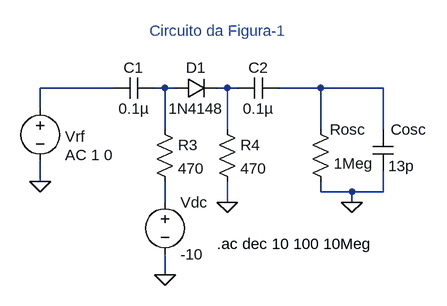
[diagram p0: schematic Chave_RF_1.asc]
Chave_RF_1.asc, the LTspice schematic file:
Version 4
SHEET 1 880 680
WIRE 80 176 -32 176
WIRE 160 176 144 176
WIRE 176 176 160 176
WIRE 256 176 240 176
WIRE 272 176 256 176
WIRE 400 176 336 176
WIRE 496 176 400 176
WIRE -32 208 -32 176
WIRE 160 240 160 176
WIRE 256 240 256 176
WIRE 400 240 400 176
WIRE 496 240 496 176
WIRE -32 320 -32 288
WIRE 400 336 400 320
WIRE 448 336 400 336
WIRE 496 336 496 304
WIRE 496 336 448 336
WIRE 160 352 160 320
WIRE 256 352 256 320
WIRE 448 352 448 336
WIRE 160 464 160 432
FLAG -32 320 0
FLAG 160 464 0
FLAG 256 352 0
FLAG 448 352 0
SYMBOL diode 176 192 R270
WINDOW 0 32 32 VTop 2
WINDOW 3 0 32 VBottom 2
SYMATTR InstName D1
SYMATTR Value 1N4148
SYMBOL cap 80 192 R270
WINDOW 0 32 32 VTop 2
WINDOW 3 0 32 VBottom 2
SYMATTR InstName C1
SYMATTR Value 0.1µ
SYMBOL cap 272 192 R270
WINDOW 0 32 32 VTop 2
WINDOW 3 0 32 VBottom 2
SYMATTR InstName C2
SYMATTR Value 0.1µ
SYMBOL voltage -32 192 R0
WINDOW 0 38 59 Left 2
WINDOW 123 38 87 Left 2
SYMATTR InstName Vrf
SYMATTR Value2 AC 1 0
SYMATTR Value ""
SYMATTR SpiceLine Rser=0
SYMBOL res 144 224 R0
SYMATTR InstName R3
SYMATTR Value 470
SYMBOL voltage 160 336 R0
WINDOW 123 0 0 Left 0
WINDOW 39 0 0 Left 0
SYMATTR InstName Vdc
SYMATTR Value -10
SYMBOL res 240 224 R0
SYMATTR InstName R4
SYMATTR Value 470
SYMBOL res 384 224 R0
WINDOW 0 30 16 Left 2
WINDOW 3 36 68 Left 2
SYMATTR InstName Rosc
SYMATTR Value 1Meg
SYMBOL cap 480 240 R0
WINDOW 0 28 0 Left 2
SYMATTR InstName Cosc
SYMATTR Value 13p
TEXT 240 416 Left 2 !.ac dec 10 100 10Meg
TEXT 136 88 Left 2 ;Circuito da Figura-1

The netlist it stands for:
* Chave_RF_1.asc
D1 N002 N003 1N4148
C1 N001 N002 0.1µ
C2 N003 N004 0.1µ
Vrf N001 0 AC 1 0 Rser=0
R3 N002 N005 470
Vdc N005 0 -10
R4 N003 0 470
Rosc N004 0 1Meg
Cosc N004 0 13p
.model D D
.lib standard.dio
.ac dec 10 100 10Meg
* Circuito da Figura-1
.backanno
.end